# Altium project CANcard.PrjPcb
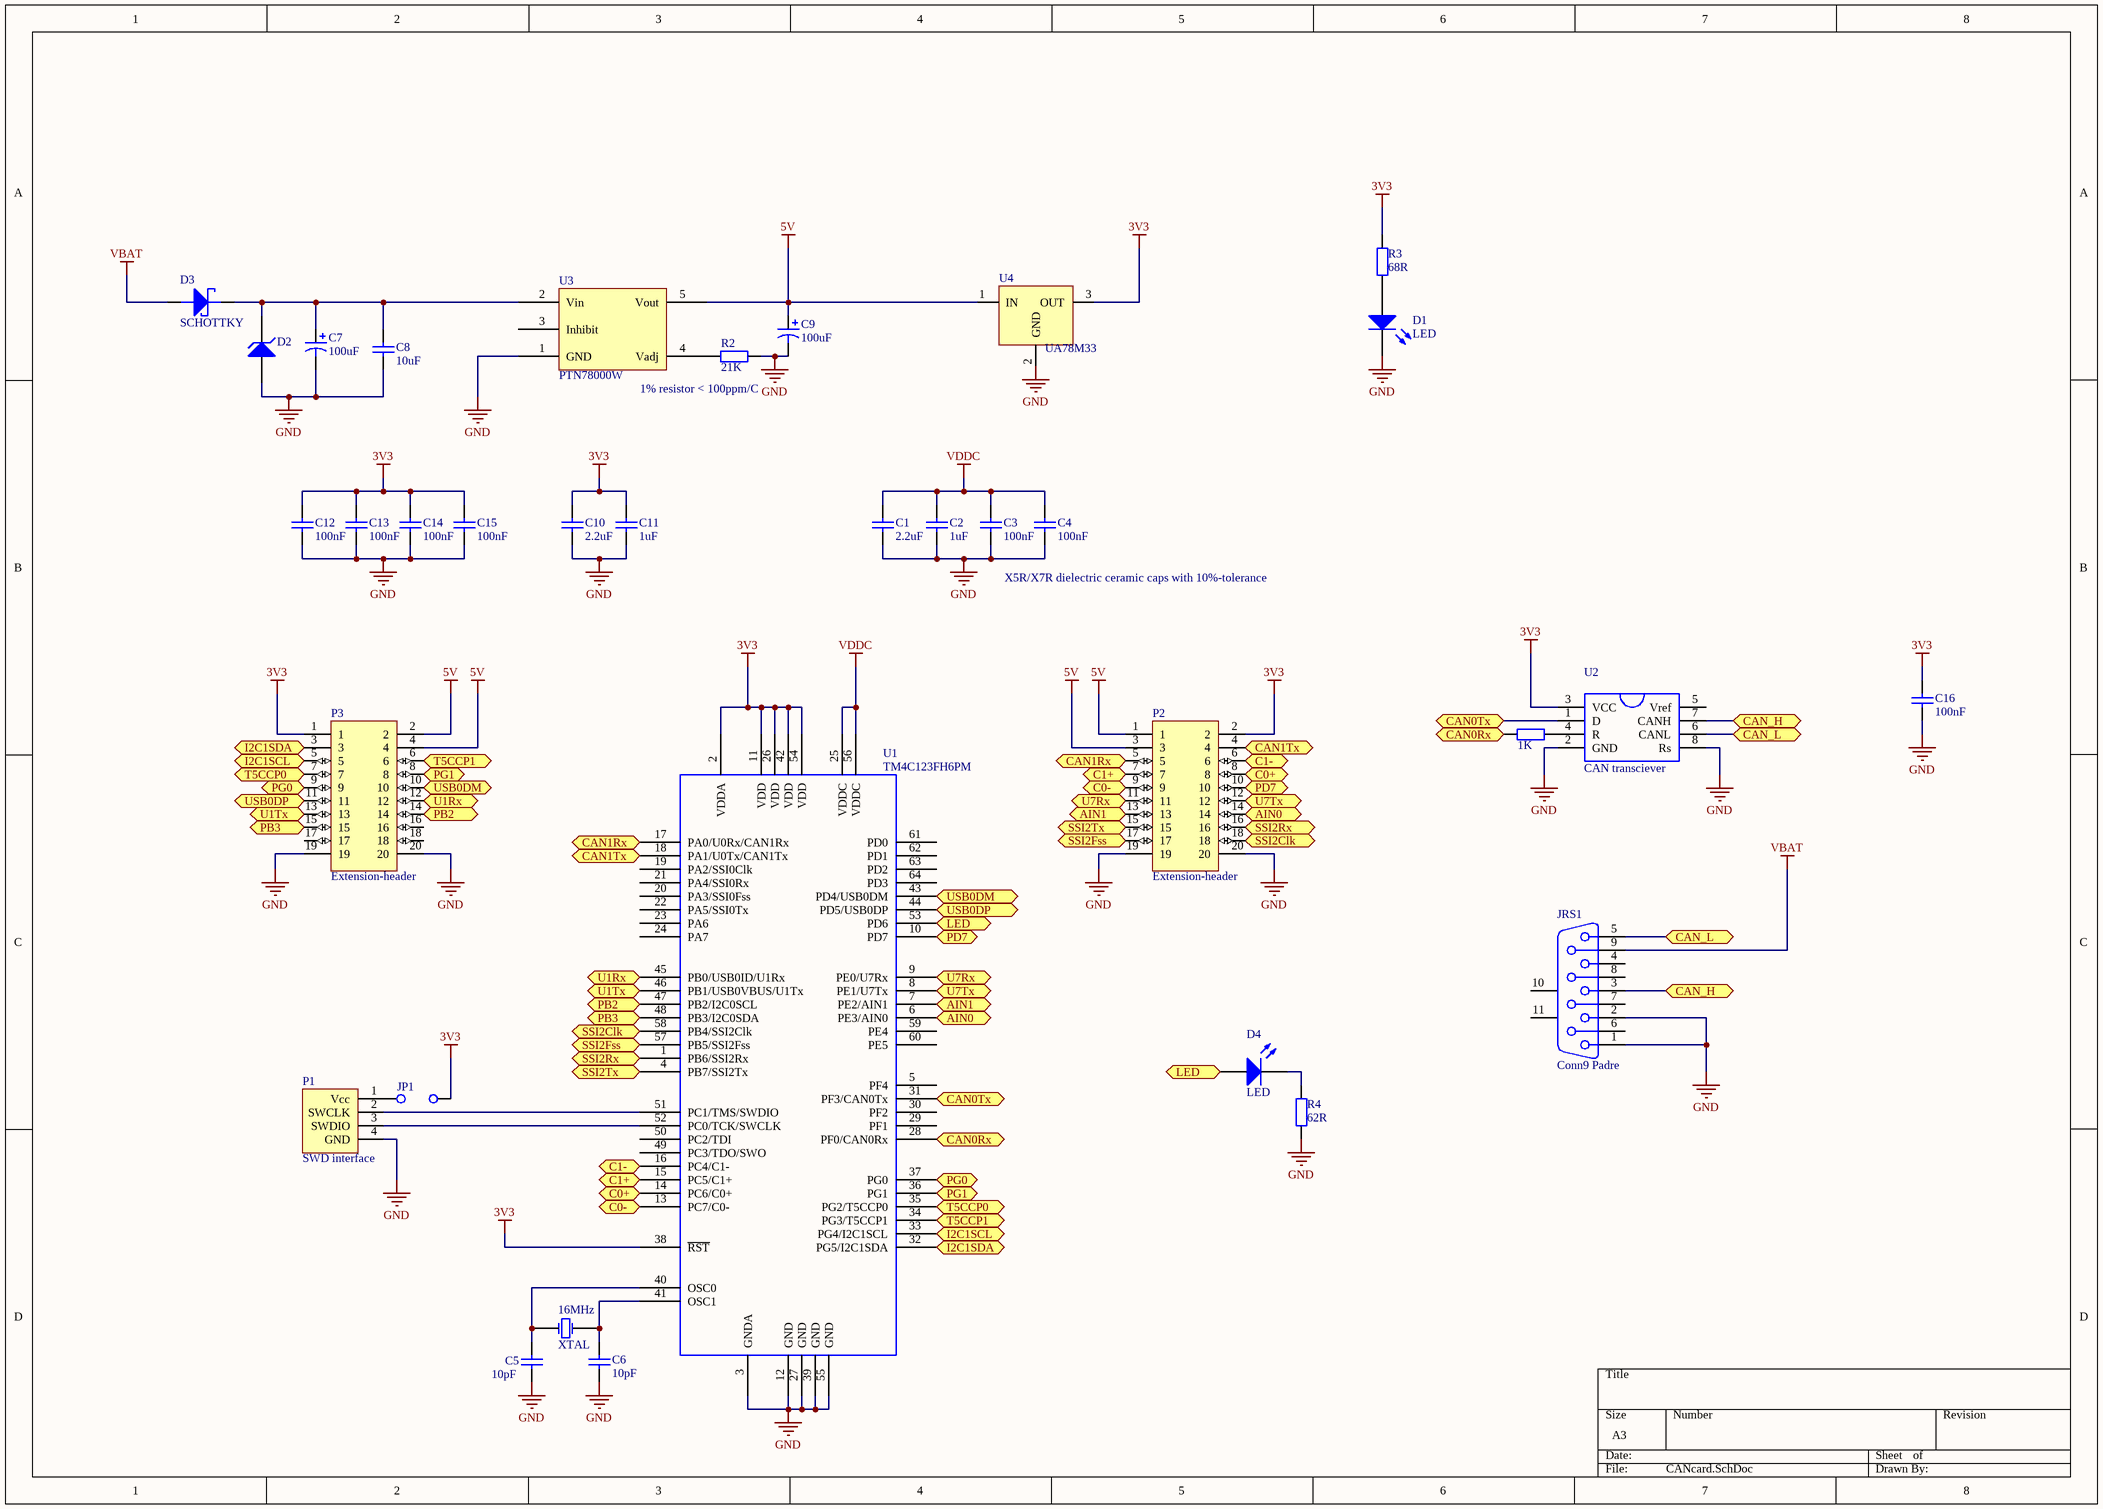
[diagram p0: CANcard.SchDoc]
1 sheet, 34 parts. Net scope: flat (ports and power ports of the same name join across sheets).
Board file: CANcard_pcb.PcbDoc

## Sheet CANcard.SchDoc
size A3

### Parts
16MHz  XTAL  [XTAL]
C1  2.2uF  [FP_0805_CAP_085]
C2  1uF  [FP_0805_CAP_085]
C3  100nF  [FP_0805_CAP_085]
C4  100nF  [FP_0805_CAP_085]
C5  10pF  [FP_0805_CAP_085]
C6  10pF  [FP_0805_CAP_085]
C7  100uF  [7343_D]
C8  10uF  [FP_0805_CAP]
C9  100uF  [3528_B]
C10  2.2uF  [FP_0805_CAP_085]
C11  1uF  [FP_0805_CAP_085]
C12  100nF  [FP_0805_CAP_085]
C13  100nF  [FP_0805_CAP_085]
C14  100nF  [FP_0805_CAP_085]
C15  100nF  [FP_0805_CAP_085]
C16  100nF  [FP_0805_CAP_085]
D1  LED  [FP_0805_LED_RED]
D2  ZENER  [DO-214AB]  (value not drawn)
D3  SCHOTTKY  [DO-214AC]
D4  LED  [FP_0805_LED_GREEN]
JP1  JUMPER  [JUMPER]  (value not drawn)
JRS1  Conn9 Padre  [RS232 MADRE]
P1  SWD interface  [DF3A-4P-2DS]
P2  Extension-header  [FH20p254pitch_thru-hole]
P3  Extension-header  [FH20p254pitch_thru-hole]
R1  1K  [FP_0805_RES]
R2  21K  [FP_0805_RES]
R3  68R  [FP_0805_RES]
R4  62R  [FP_0805_RES]
U1  TM4C123FH6PM  [LQFP64]
U2  CAN transciever  [SOP8]
U3  PTN78000W  [PTN78000WAH]
U4  UA78M33  [SOT-223]

### Ports
AIN0 (bidir), AIN1 (bidir), C0+ (bidir), C0- (bidir), C1+ (bidir), C1- (bidir), CAN0Rx, CAN0Tx, CAN1Rx (bidir), CAN1Tx (bidir), CAN_H, CAN_L, I2C1SCL (bidir), I2C1SDA (bidir), LED (bidir), PB2 (bidir), PB3 (bidir), PD7 (bidir), PG0 (bidir), PG1 (bidir), SSI2Clk (bidir), SSI2Fss (bidir), SSI2Rx (bidir), SSI2Tx (bidir), T5CCP0 (bidir), T5CCP1 (bidir), U1Rx (bidir), U1Tx (bidir), U7Rx (bidir), U7Tx (bidir), USB0DM (bidir), USB0DP (bidir)

### Nets
3V3: C10.2 C11.2 C12.2 C13.2 C14.2 C15.2 C16.2 JP1.2 P2.2 P3.1 R3.2 U1.2(VDDA) U1.11(VDD) U1.26(VDD) U1.38(~{RST}) U1.42(VDD) U1.54(VDD) U2.3(VCC) U4.3(OUT)
5V: C9.1 P2.1 P2.3 P3.2 P3.4 U3.5(Vout) U4.1(IN)
GND: C1.1 C2.1 C3.1 C4.1 C5.1 C6.1 C7.2 C8.1 C9.2 C10.1 C11.1 C12.1 C13.1 C14.1 C15.1 C16.1 D1.2(K) D2.1(A) JRS1.1 JRS1.2 P1.4(GND) P2.19 P2.20 P3.19 P3.20 R2.2 R4.1 U1.3(GNDA) U1.12(GND) U1.27(GND) U1.39(GND) U1.55(GND) U2.2(GND) U2.8(Rs) U3.1(GND) U4.2(GND)
VBAT: D3.2(ANODE) JRS1.9
VDDC: C1.2 C2.2 C3.2 C4.2 U1.25(VDDC) U1.56(VDDC)
Net16MHz_1: 16MHz.1 C5.2 U1.40(OSC0)
Net16MHz_2: 16MHz.2(OSC2) C6.2 U1.41(OSC1)
NetC7_1: C7.1 C8.2 D2.2(K) D3.1(CATHODE) U3.2(Vin)
NetD1_1: D1.1(A) R3.1
NetD4_1: D4.1(A) U1.53(PD6) ; port LED
NetD4_2: D4.2(K) R4.2
NetJP1_1: JP1.1 P1.1(Vcc)
NetJRS1_3: JRS1.3 U2.7(CANH) ; port CAN_H
NetJRS1_5: JRS1.5 U2.6(CANL) ; port CAN_L
NetP1_2: P1.2(SWCLK) U1.51(PC1/TMS/SWDIO)
NetP1_3: P1.3(SWDIO) U1.52(PC0/TCK/SWCLK)
NetP2_4: P2.4 U1.18(PA1/U0Tx/CAN1Tx) ; port CAN1Tx
NetP2_5: P2.5 U1.17(PA0/U0Rx/CAN1Rx) ; port CAN1Rx
NetP2_6: P2.6 U1.16(PC4/C1-) ; port C1-
NetP2_7: P2.7 U1.15(PC5/C1+) ; port C1+
NetP2_8: P2.8 U1.14(PC6/C0+) ; port C0+
NetP2_9: P2.9 U1.13(PC7/C0-) ; port C0-
NetP2_10: P2.10 U1.10(PD7) ; port PD7
NetP2_11: P2.11 U1.9(PE0/U7Rx) ; port U7Rx
NetP2_12: P2.12 U1.8(PE1/U7Tx) ; port U7Tx
NetP2_13: P2.13 U1.7(PE2/AIN1) ; port AIN1
NetP2_14: P2.14 U1.6(PE3/AIN0) ; port AIN0
NetP2_15: P2.15 U1.4(PB7/SSI2Tx) ; port SSI2Tx
NetP2_16: P2.16 U1.1(PB6/SSI2Rx) ; port SSI2Rx
NetP2_17: P2.17 U1.57(PB5/SSI2Fss) ; port SSI2Fss
NetP2_18: P2.18 U1.58(PB4/SSI2Clk) ; port SSI2Clk
NetP3_3: P3.3 U1.32(PG5/I2C1SDA) ; port I2C1SDA
NetP3_5: P3.5 U1.33(PG4/I2C1SCL) ; port I2C1SCL
NetP3_6: P3.6 U1.34(PG3/T5CCP1) ; port T5CCP1
NetP3_7: P3.7 U1.35(PG2/T5CCP0) ; port T5CCP0
NetP3_8: P3.8 U1.36(PG1) ; port PG1
NetP3_9: P3.9 U1.37(PG0) ; port PG0
NetP3_10: P3.10 U1.43(PD4/USB0DM) ; port USB0DM
NetP3_11: P3.11 U1.44(PD5/USB0DP) ; port USB0DP
NetP3_12: P3.12 U1.45(PB0/USB0ID/U1Rx) ; port U1Rx
NetP3_13: P3.13 U1.46(PB1/USB0VBUS/U1Tx) ; port U1Tx
NetP3_14: P3.14 U1.47(PB2/I2C0SCL) ; port PB2
NetP3_15: P3.15 U1.48(PB3/I2C0SDA) ; port PB3
NetR1_1: R1.1 U1.28(PF0/CAN0Rx) ; port CAN0Rx
NetR1_2: R1.2 U2.4(R)
NetR2_1: R2.1 U3.4(Vadj)
NetU1_31: U1.31(PF3/CAN0Tx) U2.1(D) ; port CAN0Tx

Not connected (* = marked no-connect by the designer): JRS1 4 6 7 8 10(MH1) 11(MH2); P3 16 17 18; U1 5(PF4) 19(PA2/SSI0Clk) 20(PA3/SSI0Fss) 21(PA4/SSI0Rx) 22(PA5/SSI0Tx) 23(PA6) 24(PA7) 29(PF1) 30(PF2) 49(PC3/TDO/SWO) 50(PC2/TDI) 59(PE4) 60(PE5) 61(PD0) 62(PD1) 63(PD2) 64(PD3); U2 5(Vref); U3 3(Inhibit)

### Notes on the sheet
- 1% resistor < 100ppm/C
- X5R/X7R dielectric ceramic caps with 10%-tolerance

### Library data of the parts
16MHz = XTAL: Crystal
C1-C6 C8 C10-C16 = CAP: Capacitor
  C1 C10: Value: 2.2uF
  C2 C11: Value: 1uF
  C3 C4 C12-C16: Value: 100nF
  C5 C6: Value: 10pF
  C8: Value: 10uF
C7 C9 = Cap-Elco: Polarized Capacitor; Value: 100uF
D1 D4 = LED: Typical RED GaAs LED; pin to pad: 1>A 2>K
D2 = ZENER: Zener Diode; U_br: 15
D3 = SCHOTTKY: NXP - PMEG3020EJ,115 - SCHOTTKY RECT 30V 2A SOD323F; Supplier: Farnell 1757772
JP1 = JUMPER: Jumper Wire; Supplier: Farnell 1668537×1/6
JRS1 = RS232 Padre Connector 9: RS232 On Board Conn Padre; Manufacturer: Generic Components; Positions: 9; Gender: Receptacle; Published: 15/06/2001; Publisher: Altium Hobart Technology Centre; Class: Connector; Orientation: Right Angle
P1 = SWDinterface: 4 pole connector for debugging and programming; Supplier: Farnell: 1711329; Type: MOLEX - 87438-0443
P2 P3 = Extension header
R1-R4 = RES: Resistor
  R1: Value: 1K
  R2: Value: 21K
  R3: Value: 68R
  R4: Value: 62R
U1 = TM4C123FH6PM: Tiva ARM Cortex-M3 Microcontroller; Manufacturer #1: Texas Instruments; Part Number: TM4C123FH6PMI; Designator: U; Comment_1: TM4C123FH6PM
U2 = SN65HVD231: Manufacturer: Generic Components; Published: 1999
U3 = PTN78000W: 1.5-A, WIDE-INPUT ADJUSTABLE SWITCHING REGULATOR
U4 = UA78M33: Fixed output LDO up to 0.5A; Supplier: TI sample